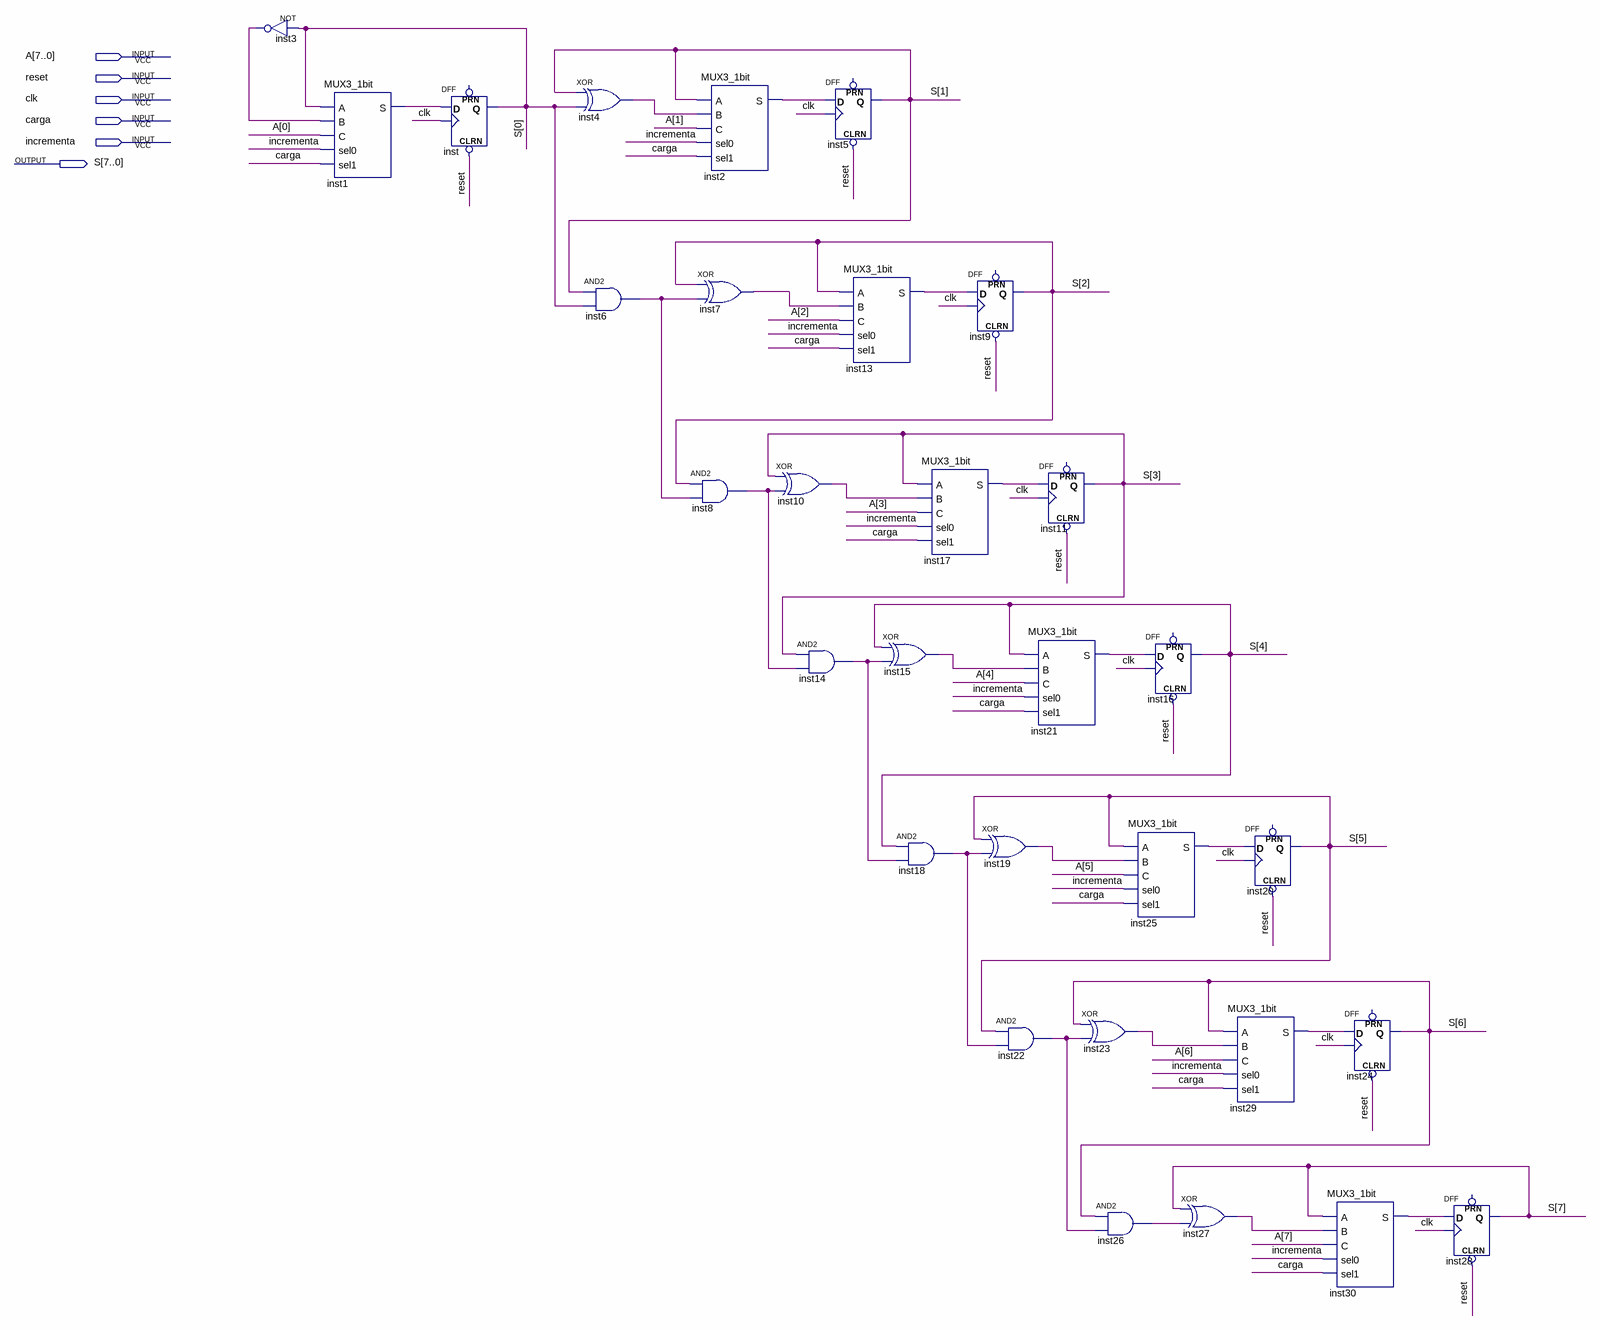
[diagram p0: schematic sheet]
// Quartus schematic Neander_PC.bdf as structural Verilog: 30 symbols, 6 pins
module Neander_PC (
  input  [7:0] A,
  input  reset,
  input  clk,
  input  carga,
  input  incrementa,
  output [7:0] S
);

  wire inst1_s, inst2_s, inst3_out, inst4_out, inst6_out, inst7_out, inst8_out, inst10_out, inst13_s,
       inst14_out, inst15_out, inst17_s, inst18_out, inst19_out, inst21_s, inst22_out, inst23_out, inst25_s,
       inst26_out, inst27_out, inst29_s, inst30_s;

  not inst3 (inst3_out, S[0]);
  MUX3_1bit inst1 (.A(S[0]), .B(inst3_out), .C(A[0]), .sel0(incrementa), .sel1(carga), .S(inst1_s));
  DFF inst (.CLRN(reset), .CLK(clk), .D(inst1_s), .Q(S[0]));  // open: PRN
  xor inst4 (inst4_out, S[1], S[0]);
  and inst6 (inst6_out, S[1], S[0]);
  MUX3_1bit inst2 (.A(S[1]), .B(inst4_out), .C(A[1]), .sel0(incrementa), .sel1(carga), .S(inst2_s));
  xor inst7 (inst7_out, S[2], inst6_out);
  and inst8 (inst8_out, S[2], inst6_out);
  xor inst10 (inst10_out, S[3], inst8_out);
  DFF inst5 (.CLRN(reset), .CLK(clk), .D(inst2_s), .Q(S[1]));  // open: PRN
  MUX3_1bit inst13 (.A(S[2]), .B(inst7_out), .C(A[2]), .sel0(incrementa), .sel1(carga), .S(inst13_s));
  and inst14 (inst14_out, S[3], inst8_out);
  xor inst15 (inst15_out, S[4], inst14_out);
  and inst18 (inst18_out, S[4], inst14_out);
  MUX3_1bit inst17 (.A(S[3]), .B(inst10_out), .C(A[3]), .sel0(incrementa), .sel1(carga), .S(inst17_s));
  DFF inst9 (.CLRN(reset), .CLK(clk), .D(inst13_s), .Q(S[2]));  // open: PRN
  xor inst19 (inst19_out, S[5], inst18_out);
  and inst22 (inst22_out, S[5], inst18_out);
  DFF inst11 (.CLRN(reset), .CLK(clk), .D(inst17_s), .Q(S[3]));  // open: PRN
  MUX3_1bit inst21 (.A(S[4]), .B(inst15_out), .C(A[4]), .sel0(incrementa), .sel1(carga), .S(inst21_s));
  MUX3_1bit inst25 (.A(S[5]), .B(inst19_out), .C(A[5]), .sel0(incrementa), .sel1(carga), .S(inst25_s));
  xor inst23 (inst23_out, S[6], inst22_out);
  and inst26 (inst26_out, S[6], inst22_out);
  DFF inst16 (.CLRN(reset), .CLK(clk), .D(inst21_s), .Q(S[4]));  // open: PRN
  xor inst27 (inst27_out, S[7], inst26_out);
  DFF inst20 (.CLRN(reset), .CLK(clk), .D(inst25_s), .Q(S[5]));  // open: PRN
  MUX3_1bit inst29 (.A(S[6]), .B(inst23_out), .C(A[6]), .sel0(incrementa), .sel1(carga), .S(inst29_s));
  DFF inst24 (.CLRN(reset), .CLK(clk), .D(inst29_s), .Q(S[6]));  // open: PRN
  MUX3_1bit inst30 (.A(S[7]), .B(inst27_out), .C(A[7]), .sel0(incrementa), .sel1(carga), .S(inst30_s));
  DFF inst28 (.CLRN(reset), .CLK(clk), .D(inst30_s), .Q(S[7]));  // open: PRN
endmodule
